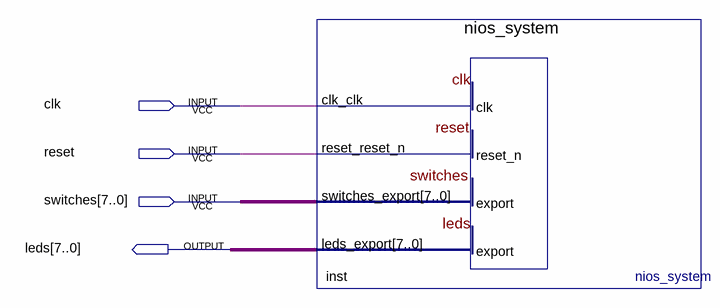
[diagram p0: schematic sheet]
// Quartus schematic light.bdf as structural Verilog: 1 symbols, 4 pins
module light (
  input  clk,
  input  reset,
  input  [7:0] switches,
  output [7:0] leds
);

  nios_system inst (.clk_clk(clk), .reset_reset_n(reset), .switches_export(switches), .leds_export(leds));
endmodule
